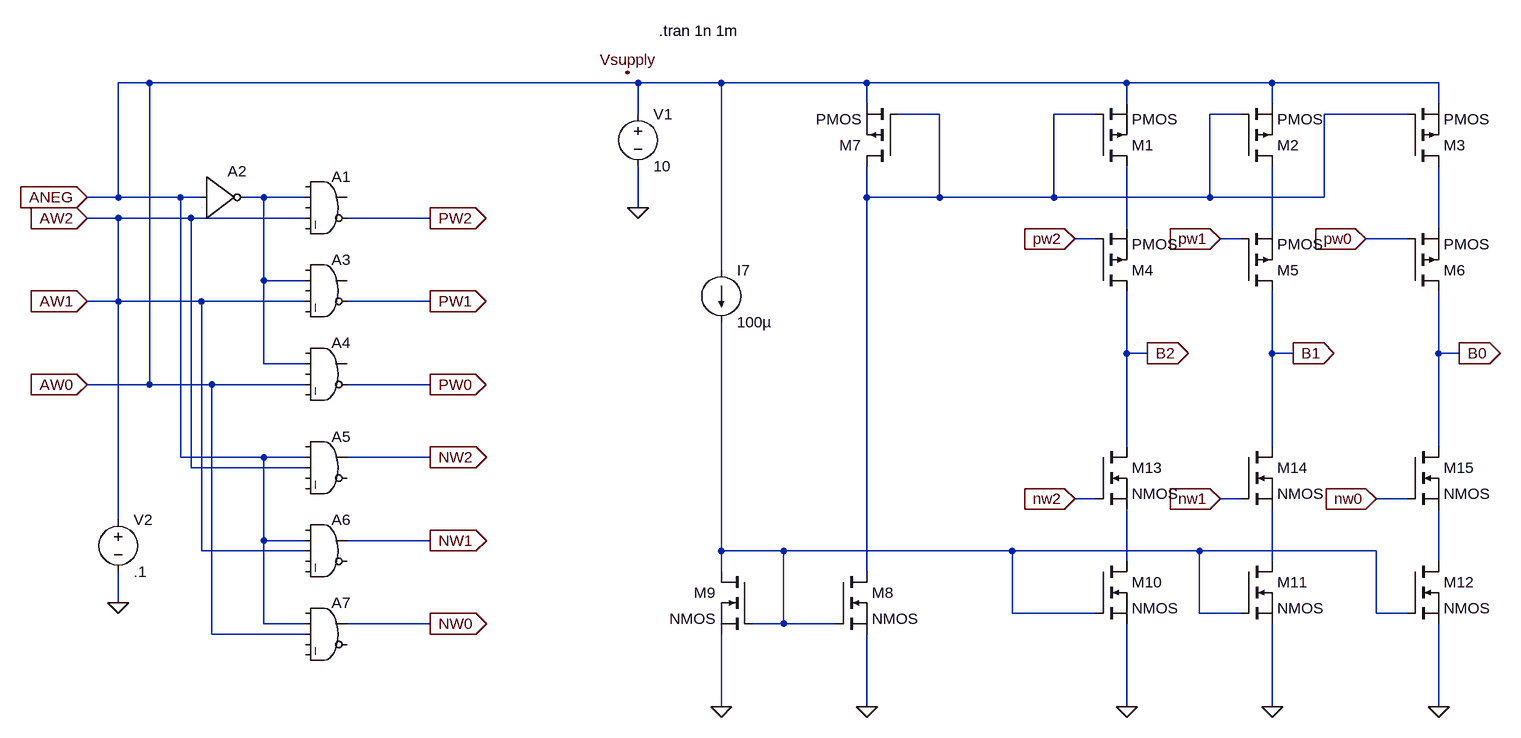
[diagram p0: schematic simple_mirror_negweight.asc]
simple_mirror_negweight.asc, the LTspice schematic file:
Version 4
SHEET 1 1200 704
WIRE -1552 -368 -1600 -368
WIRE -800 -368 -1552 -368
WIRE -672 -368 -800 -368
WIRE -448 -368 -672 -368
WIRE -48 -368 -448 -368
WIRE 176 -368 -48 -368
WIRE 432 -368 176 -368
WIRE -448 -336 -448 -368
WIRE -48 -336 -48 -368
WIRE 176 -336 176 -368
WIRE 432 -336 432 -368
WIRE -800 -320 -800 -368
WIRE -336 -320 -400 -320
WIRE -96 -320 -160 -320
WIRE 128 -320 80 -320
WIRE 384 -320 256 -320
WIRE -1600 -192 -1600 -368
WIRE -1600 -192 -1648 -192
WIRE -1504 -192 -1600 -192
WIRE -1472 -192 -1504 -192
WIRE -1376 -192 -1408 -192
WIRE -1312 -192 -1376 -192
WIRE -448 -192 -448 -240
WIRE -336 -192 -336 -320
WIRE -336 -192 -448 -192
WIRE -160 -192 -160 -320
WIRE -160 -192 -336 -192
WIRE 80 -192 80 -320
WIRE 80 -192 -160 -192
WIRE 256 -192 256 -320
WIRE 256 -192 80 -192
WIRE -800 -176 -800 -240
WIRE -1600 -160 -1648 -160
WIRE -1488 -160 -1600 -160
WIRE -1312 -160 -1488 -160
WIRE -1120 -160 -1248 -160
WIRE -48 -144 -48 -240
WIRE 176 -144 176 -240
WIRE 432 -144 432 -240
WIRE -96 -128 -128 -128
WIRE 128 -128 96 -128
WIRE 384 -128 320 -128
WIRE -672 -80 -672 -368
WIRE -1376 -64 -1376 -192
WIRE -1312 -64 -1376 -64
WIRE -1600 -32 -1600 -160
WIRE -1600 -32 -1648 -32
WIRE -1472 -32 -1600 -32
WIRE -1312 -32 -1472 -32
WIRE -1120 -32 -1248 -32
WIRE -48 48 -48 -48
WIRE -16 48 -48 48
WIRE 176 48 176 -48
WIRE 208 48 176 48
WIRE 432 48 432 -48
WIRE 464 48 432 48
WIRE -1376 64 -1376 -64
WIRE -1312 64 -1376 64
WIRE -1552 96 -1552 -368
WIRE -1552 96 -1648 96
WIRE -1456 96 -1552 96
WIRE -1312 96 -1456 96
WIRE -1120 96 -1248 96
WIRE -48 192 -48 48
WIRE 176 192 176 48
WIRE 432 192 432 48
WIRE -1504 208 -1504 -192
WIRE -1376 208 -1504 208
WIRE -1312 208 -1376 208
WIRE -1120 208 -1248 208
WIRE -1488 224 -1488 -160
WIRE -1312 224 -1488 224
WIRE -96 272 -128 272
WIRE 128 272 96 272
WIRE 384 272 336 272
WIRE -1600 304 -1600 -32
WIRE -1376 336 -1376 208
WIRE -1312 336 -1376 336
WIRE -1120 336 -1248 336
WIRE -1472 352 -1472 -32
WIRE -1312 352 -1472 352
WIRE -672 352 -672 0
WIRE -576 352 -672 352
WIRE -224 352 -576 352
WIRE 64 352 -224 352
WIRE 336 352 64 352
WIRE -48 368 -48 288
WIRE 176 368 176 288
WIRE 432 368 432 288
WIRE -672 384 -672 352
WIRE -448 384 -448 -192
WIRE -1600 432 -1600 384
WIRE -224 448 -224 352
WIRE -96 448 -224 448
WIRE 64 448 64 352
WIRE 128 448 64 448
WIRE 336 448 336 352
WIRE 384 448 336 448
WIRE -1376 464 -1376 336
WIRE -1312 464 -1376 464
WIRE -1120 464 -1248 464
WIRE -576 464 -576 352
WIRE -576 464 -624 464
WIRE -496 464 -576 464
WIRE -1456 480 -1456 96
WIRE -1312 480 -1456 480
WIRE -672 592 -672 480
WIRE -448 592 -448 480
WIRE -48 592 -48 464
WIRE 176 592 176 464
WIRE 432 592 432 464
FLAG -448 592 0
FLAG -800 -176 0
FLAG -816 -384 Vsupply
FLAG -128 -128 pw2
IOPIN -128 -128 In
FLAG 96 -128 pw1
IOPIN 96 -128 In
FLAG 320 -128 pw0
IOPIN 320 -128 In
FLAG -672 592 0
FLAG -48 592 0
FLAG 176 592 0
FLAG 432 592 0
FLAG 336 272 nw0
IOPIN 336 272 In
FLAG 96 272 nw1
IOPIN 96 272 In
FLAG -128 272 nw2
IOPIN -128 272 In
FLAG -1648 -192 ANEG
IOPIN -1648 -192 In
FLAG -1120 -160 PW2
IOPIN -1120 -160 Out
FLAG -1120 -32 PW1
IOPIN -1120 -32 Out
FLAG -1120 96 PW0
IOPIN -1120 96 Out
FLAG -1648 -160 AW2
IOPIN -1648 -160 In
FLAG -1648 -32 AW1
IOPIN -1648 -32 In
FLAG -1648 96 AW0
IOPIN -1648 96 In
FLAG -1120 208 NW2
IOPIN -1120 208 Out
FLAG -1120 336 NW1
IOPIN -1120 336 Out
FLAG -1120 464 NW0
IOPIN -1120 464 Out
FLAG -1600 432 0
FLAG -16 48 B2
IOPIN -16 48 Out
FLAG 208 48 B1
IOPIN 208 48 Out
FLAG 464 48 B0
IOPIN 464 48 Out
SYMBOL pmos -96 -240 M180
SYMATTR InstName M1
SYMBOL voltage -800 -336 R0
SYMATTR InstName V1
SYMATTR Value 10
SYMBOL pmos -400 -240 R180
SYMATTR InstName M7
SYMBOL current -672 -80 R0
SYMATTR InstName I7
SYMATTR Value 100µ
SYMBOL pmos 128 -240 M180
SYMATTR InstName M2
SYMBOL pmos 384 -240 M180
SYMATTR InstName M3
SYMBOL pmos -96 -48 M180
SYMATTR InstName M4
SYMBOL pmos 128 -48 M180
SYMATTR InstName M5
SYMBOL pmos 384 -48 M180
SYMATTR InstName M6
SYMBOL nmos -496 384 R0
SYMATTR InstName M8
SYMBOL nmos -624 384 M0
SYMATTR InstName M9
SYMBOL nmos -96 368 R0
SYMATTR InstName M10
SYMBOL nmos 128 368 R0
SYMATTR InstName M11
SYMBOL nmos 384 368 R0
SYMATTR InstName M12
SYMBOL nmos -96 192 R0
SYMATTR InstName M13
SYMBOL nmos 128 192 R0
SYMATTR InstName M14
SYMBOL nmos 384 192 R0
SYMATTR InstName M15
SYMBOL Digital/and -1280 -240 R0
WINDOW 3 16 46 Invisible 2
SYMATTR Value vhigh=10
SYMATTR InstName A1
SYMBOL Digital/inv -1472 -256 R0
WINDOW 3 8 104 Invisible 2
SYMATTR Value vhigh=10
SYMATTR InstName A2
SYMBOL Digital/and -1280 -112 R0
WINDOW 3 16 46 Invisible 2
SYMATTR Value vhigh=10
SYMATTR InstName A3
SYMBOL Digital/and -1280 16 R0
WINDOW 3 16 46 Invisible 2
SYMATTR Value vhigh=10
SYMATTR InstName A4
SYMBOL Digital/and -1280 160 R0
WINDOW 3 16 46 Invisible 2
SYMATTR Value vhigh=10
SYMATTR InstName A5
SYMBOL Digital/and -1280 288 R0
WINDOW 3 16 46 Invisible 2
SYMATTR Value vhigh=10
SYMATTR InstName A6
SYMBOL Digital/and -1280 416 R0
WINDOW 3 16 46 Invisible 2
SYMATTR Value vhigh=10
SYMATTR InstName A7
SYMBOL voltage -1600 288 R0
SYMATTR InstName V2
SYMATTR Value .1
TEXT -768 -448 Left 2 !.tran 1n 1m

The netlist it stands for:
* simple_mirror_negweight.asc
M1 N003 N001 AW0 AW0 PMOS
V1 AW0 0 10
M7 N001 N001 AW0 AW0 PMOS
I7 AW0 N006 100µ
M2 N004 N001 AW0 AW0 PMOS
M3 N005 N001 AW0 AW0 PMOS
M4 B2 pw2 N003 N003 PMOS
M5 B1 pw1 N004 N004 PMOS
M6 B0 pw0 N005 N005 PMOS
M8 N001 N006 0 0 NMOS
M9 N006 N006 0 0 NMOS
M10 N007 N006 0 0 NMOS
M11 N008 N006 0 0 NMOS
M12 N009 N006 0 0 NMOS
M13 B2 nw2 N007 N007 NMOS
M14 B1 nw1 N008 N008 NMOS
M15 B0 nw0 N009 N009 NMOS
A1 0 N002 0 AW1 0 pw2 0 0 AND vhigh=10
A2 AW0 0 0 0 0 N002 0 0 BUF vhigh=10
A3 0 N002 0 AW1 0 pw1 0 0 AND vhigh=10
A4 0 N002 0 AW0 0 pw0 0 0 AND vhigh=10
A5 0 AW0 AW1 0 0 0 nw2 0 AND vhigh=10
A6 0 AW0 AW1 0 0 0 nw1 0 AND vhigh=10
A7 0 AW0 AW0 0 0 0 nw0 0 AND vhigh=10
V2 AW1 0 .1
.model NMOS NMOS
.model PMOS PMOS
.lib standard.mos
.tran 1n 1m
.backanno
.end